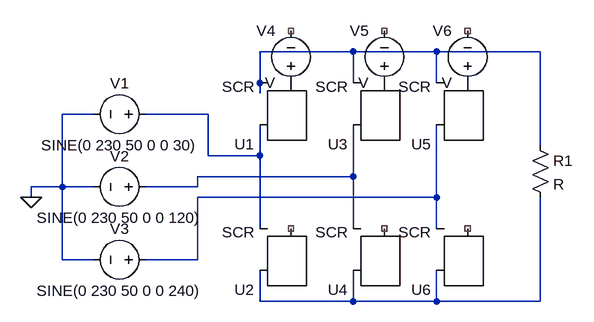
[diagram p0: schematic 3Phase_SCR_rectifier.asc]
3Phase_SCR_rectifier.asc, the LTspice schematic file:
Version 4
SHEET 1 880 680
WIRE 352 64 208 64
WIRE 480 64 352 64
WIRE 640 64 480 64
WIRE 208 112 208 64
WIRE 352 112 352 64
WIRE 480 112 480 64
WIRE 208 128 208 112
WIRE -48 160 -96 160
WIRE 128 160 32 160
WIRE 640 208 640 64
WIRE 128 224 128 160
WIRE 208 224 208 176
WIRE 208 224 128 224
WIRE 352 256 352 176
WIRE 352 256 112 256
WIRE -96 272 -96 160
WIRE -96 272 -144 272
WIRE -48 272 -96 272
WIRE 112 272 112 256
WIRE 112 272 32 272
WIRE -144 288 -144 272
WIRE 480 288 480 176
WIRE 480 288 112 288
WIRE 208 336 208 224
WIRE 352 336 352 256
WIRE 480 336 480 288
WIRE -96 384 -96 272
WIRE -48 384 -96 384
WIRE 112 384 112 288
WIRE 112 384 32 384
WIRE 208 448 208 400
WIRE 352 448 352 400
WIRE 352 448 208 448
WIRE 480 448 480 400
WIRE 480 448 352 448
WIRE 640 448 640 288
WIRE 640 448 480 448
FLAG -144 288 0
SYMBOL Misc\\SCR 224 176 R180
SYMATTR InstName U1
SYMBOL Misc\\SCR 224 400 R180
SYMATTR InstName U2
SYMBOL Misc\\SCR 368 176 R180
SYMATTR InstName U3
SYMBOL Misc\\SCR 368 400 R180
SYMATTR InstName U4
SYMBOL res 624 192 R0
SYMATTR InstName R1
SYMBOL Misc\\SCR 496 176 R180
SYMATTR InstName U5
SYMBOL Misc\\SCR 496 400 R180
SYMATTR InstName U6
SYMBOL voltage 48 160 R90
WINDOW 0 -32 56 VBottom 2
WINDOW 3 32 56 VTop 2
WINDOW 123 0 0 Left 0
WINDOW 39 0 0 Left 0
SYMATTR InstName V1
SYMATTR Value SINE(0 230 50 0 0 30)
SYMBOL voltage 48 272 R90
WINDOW 0 -32 56 VBottom 2
WINDOW 3 32 56 VTop 2
WINDOW 123 0 0 Left 0
WINDOW 39 0 0 Left 0
SYMATTR InstName V2
SYMATTR Value SINE(0 230 50 0 0 120)
SYMBOL voltage 48 384 R90
WINDOW 0 -32 56 VBottom 2
WINDOW 3 32 56 VTop 2
WINDOW 123 0 0 Left 0
WINDOW 39 0 0 Left 0
SYMATTR InstName V3
SYMATTR Value SINE(0 230 50 0 0 240)
SYMBOL voltage 256 128 R180
WINDOW 0 24 96 Left 2
WINDOW 3 24 16 Left 2
SYMATTR InstName V4
SYMBOL voltage 400 128 R180
WINDOW 0 24 96 Left 2
WINDOW 3 24 16 Left 2
SYMATTR InstName V5
SYMBOL voltage 528 128 R180
WINDOW 0 24 96 Left 2
WINDOW 3 24 16 Left 2
SYMATTR InstName V6

The netlist it stands for:
* 3Phase_SCR_rectifier.asc
* U1: SCR (symbol Misc\SCR not certain, pin order unknown); nets seen at it: N001, N002, P001
* U2: SCR (symbol Misc\SCR not certain, pin order unknown); nets seen at it: N002, N005
* U3: SCR (symbol Misc\SCR not certain, pin order unknown); nets seen at it: N001, N003, P002
* U4: SCR (symbol Misc\SCR not certain, pin order unknown); nets seen at it: N003, N005
R1 N001 N005 R
* U5: SCR (symbol Misc\SCR not certain, pin order unknown); nets seen at it: N001, N004, P003
* U6: SCR (symbol Misc\SCR not certain, pin order unknown); nets seen at it: N004, N005
V1 N002 0 SINE(0 230 50 0 0 30)
V2 N003 0 SINE(0 230 50 0 0 120)
V3 N004 0 SINE(0 230 50 0 0 240)
V4 P001 NC_04 V
V5 P002 NC_05 V
V6 P003 NC_06 V
.backanno
.end